# EAGLE design LightPlay1.1 (EAGLE 7.2.0)
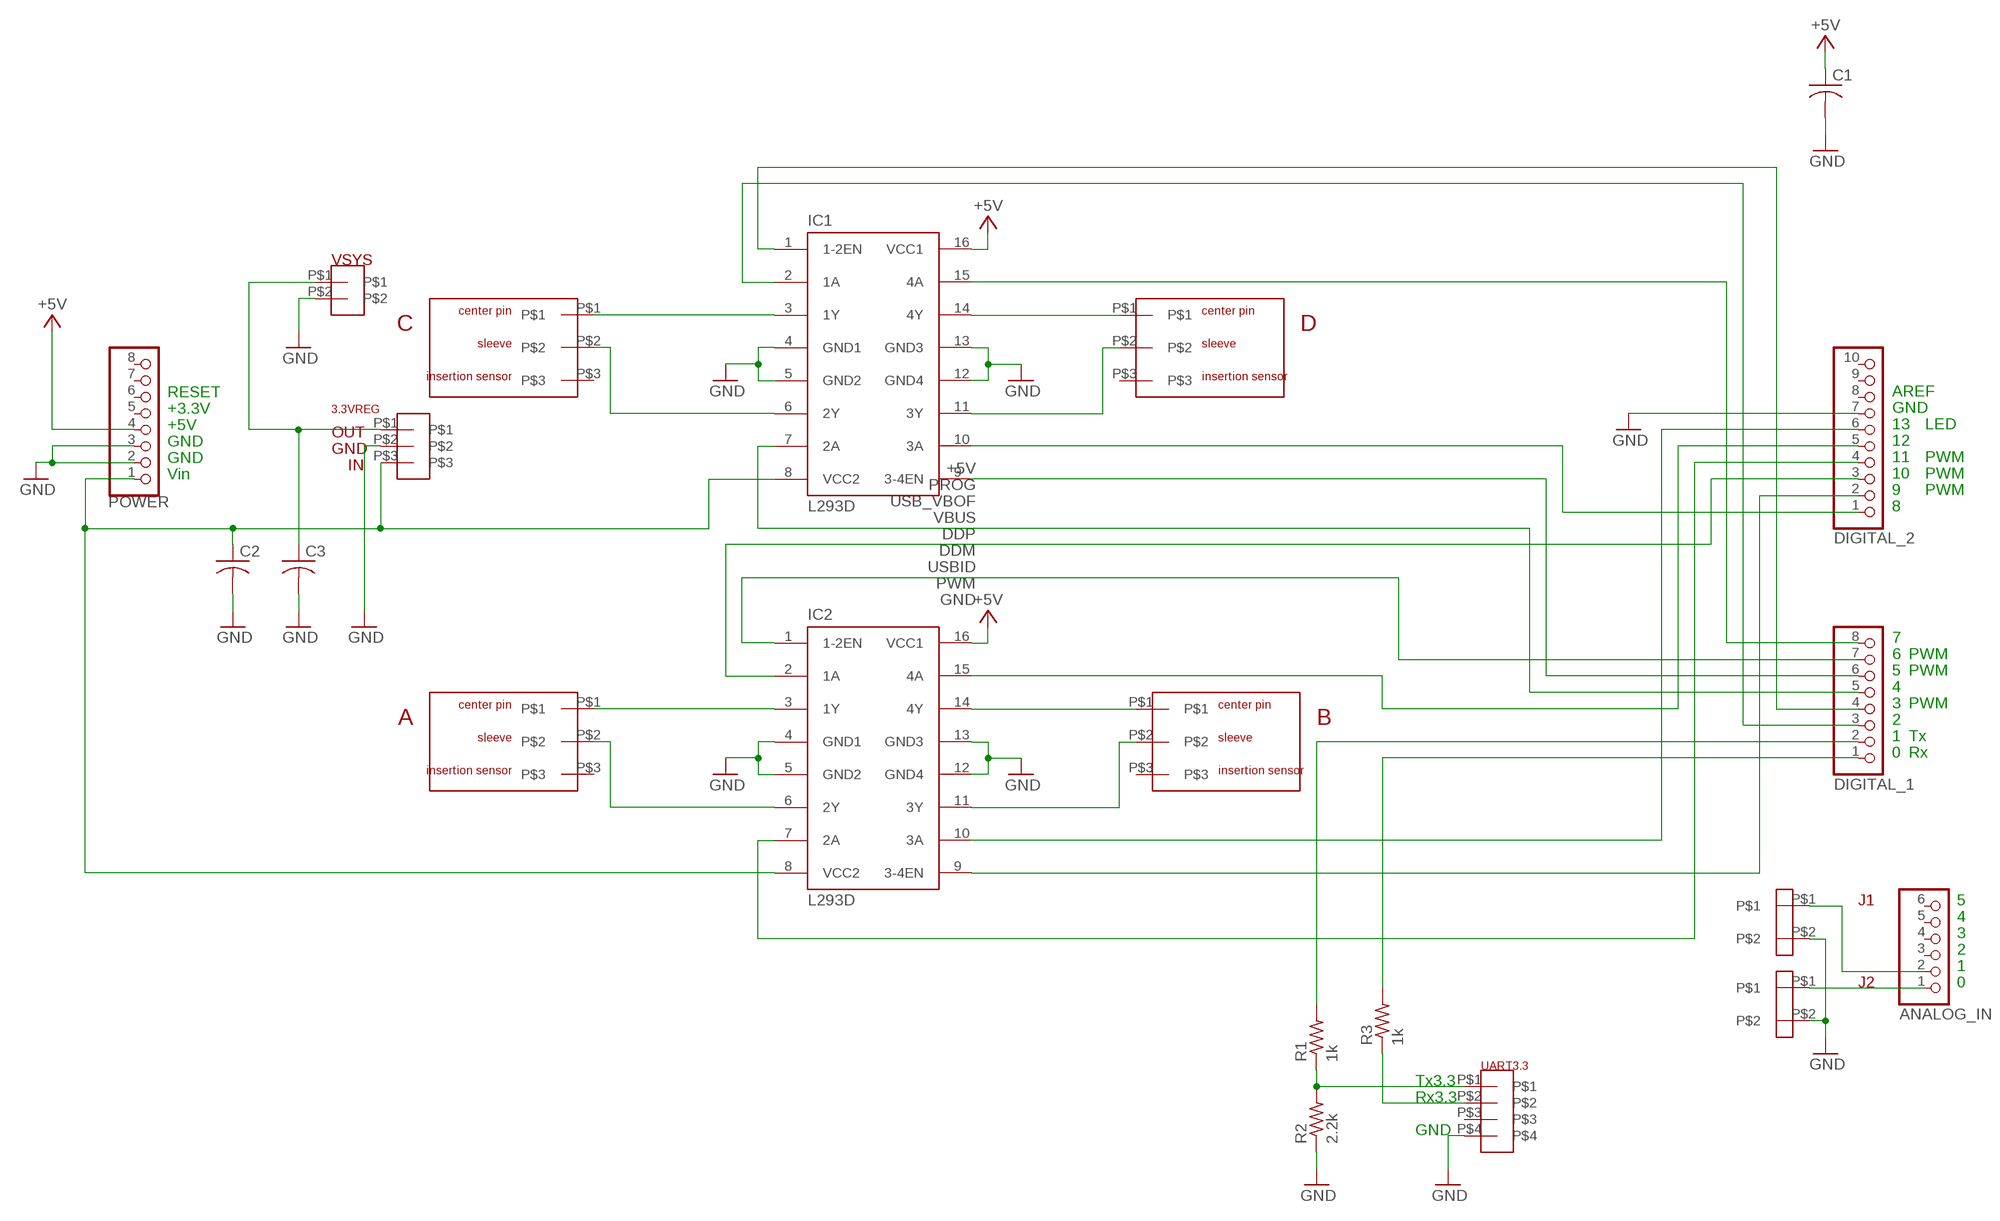
[diagram p0: schematic, sheet 1]

## Parts
3.3VREG  LP38691_33REG  [TO-252]
A  PJ-075DH-SMT-TR  [PJ-075DH-SMT-TR]
ANALOG_IN  PINHD-1X6TH  [1X06-TH]
B  PJ-075DH-SMT-TR  [PJ-075DH-SMT-TR]
C  PJ-075DH-SMT-TR  [PJ-075DH-SMT-TR]
C1  C-USC1206  [C1206]
C2  C-USC1206  [C1206]
C3  C-USC1206  [C1206]
D  PJ-075DH-SMT-TR  [PJ-075DH-SMT-TR]
DIGITAL_1  PINHD-1X8TH  [1X08-TH]
DIGITAL_2  PINHD-1X10TH  [1X10-TH]
IC1  L293D  [DIL16]
IC2  L293D  [DIL16]
J1  3.5MM_2PIN_SCREWTERMINAL_SPARKFUN  [1X02_3.5_SCREWTERM]
J2  3.5MM_2PIN_SCREWTERMINAL_SPARKFUN  [1X02_3.5_SCREWTERM]
POWER  PINHD-1X8TH  [1X08-TH]
R1  1k  R-US_M1206  [M1206]
R2  2.2k  R-US_M1206  [M1206]
R3  1k  R-US_M1206  [M1206]
UART3.3  4PADS_ROBBIE  [1X04_ROBBIE]
VSYS  1X2HEADER_ROBBIE  [1X2HEADER_ROBBIE]

## Nets
+5V: C1.1 IC1.16(VCC1) IC2.16(VCC1) POWER.4
GND: 3.3VREG.P$2 C1.2 C2.2 C3.2 DIGITAL_2.7 IC1.4(GND1) IC1.5(GND2) IC1.12(GND4) IC1.13(GND3) IC2.4(GND1) IC2.5(GND2) IC2.12(GND4) IC2.13(GND3) J1.P$2 J2.P$2 POWER.2 POWER.3 R2.1 UART3.3.P$4 VSYS.P$2
N$1: D.P$2 IC1.11(3Y)
N$2: ANALOG_IN.1 J2.P$1
N$3: D.P$1 IC1.14(4Y)
N$4: B.P$1 IC2.14(4Y)
N$5: ANALOG_IN.2 J1.P$1
N$6: 3.3VREG.P$3 C2.1 IC1.8(VCC2) IC2.8(VCC2) POWER.1
N$7: B.P$2 IC2.11(3Y)
N$8: C.P$1 IC1.3(1Y)
N$9: C.P$2 IC1.6(2Y)
N$10: A.P$1 IC2.3(1Y)
N$11: A.P$2 IC2.6(2Y)
N$12: DIGITAL_1.4 IC1.1(1-2EN)
N$13: DIGITAL_1.6 IC1.9(3-4EN)
N$14: DIGITAL_1.7 IC2.1(1-2EN)
N$15: DIGITAL_2.2 IC2.9(3-4EN)
N$16: DIGITAL_1.3 IC1.2(1A)
N$17: DIGITAL_1.5 IC1.7(2A)
N$18: DIGITAL_1.8 IC1.15(4A)
N$19: DIGITAL_2.1 IC1.10(3A)
N$20: DIGITAL_2.3 IC2.2(1A)
N$21: DIGITAL_2.4 IC2.7(2A)
N$22: DIGITAL_2.5 IC2.15(4A)
N$23: DIGITAL_2.6 IC2.10(3A)
N$25: 3.3VREG.P$1 C3.1 VSYS.P$1
N$26: R1.1 R2.2 UART3.3.P$1
N$27: DIGITAL_1.2 R1.2
N$28: DIGITAL_1.1 R3.2
N$29: R3.1 UART3.3.P$2
Unconnected: A.P$3 ANALOG_IN.3 ANALOG_IN.4 ANALOG_IN.5 ANALOG_IN.6 B.P$3 C.P$3 D.P$3 DIGITAL_2.8 DIGITAL_2.9 DIGITAL_2.10 POWER.5 POWER.6 POWER.7 POWER.8 UART3.3.P$3

## Notes on the sheet
- RESET | AREF
- +3.3V | GND
- +5V | 13 | LED
- GND | 12
- GND | +5V | 11 | PWM
- Vin | PROG | 10 | PWM
- USB_VBOF | 9 | PWM
- VBUS | 8
- DDP
- DDM
- USBID
- PWM
- GND
- 7
- 6 | PWM
- 5 | PWM
- 4
- 3 | PWM
- 2
- 1 | Tx
- 0 | Rx
- 5
- 4
- 3
- 2
- 1
- 0
- Tx3.3
- Rx3.3
- GND

## Library data of the parts
3.3VREG = robbie:LP38691_33REG
A B C D = robbie:PJ-075DH-SMT-TR
ANALOG_IN = SmartPrj:PINHD-1X6: PIN HEADER
C1-C3 = resistor:C-US: CAPACITOR, American symbol
DIGITAL_1 POWER = SmartPrj:PINHD-1X8: PIN HEADER
DIGITAL_2 = SmartPrj:PINHD-1X10: PIN HEADER
IC1 IC2 = st-microelectronics:L293D: PUSH-PULL 4 CHANNEL DRIVER; MPN: L293D; OC_FARNELL: 9589619; OC_NEWARK: 56P8249
J1 J2 = robbie:3.5MM_2PIN_SCREWTERMINAL_SPARKFUN
R1-R3 = robbie:R-US_: RESISTOR, American symbol
UART3.3 = robbie:4PADS_ROBBIE
VSYS = robbie:1X2HEADER_ROBBIE

## Net classes
0 default: width 0.203 mm, drill 0.305 mm, clearance 0.178 mm
1 power: width 0.254 mm, drill 0.61 mm, clearance 0.203 mm
2 VIN: width 0.61 mm, drill 0.813 mm, clearance 0.305 mm
3 usbvcc: width 0.508 mm, drill 0.508 mm, clearance 0.152 mm
4 aref: width 0.406 mm

## Board
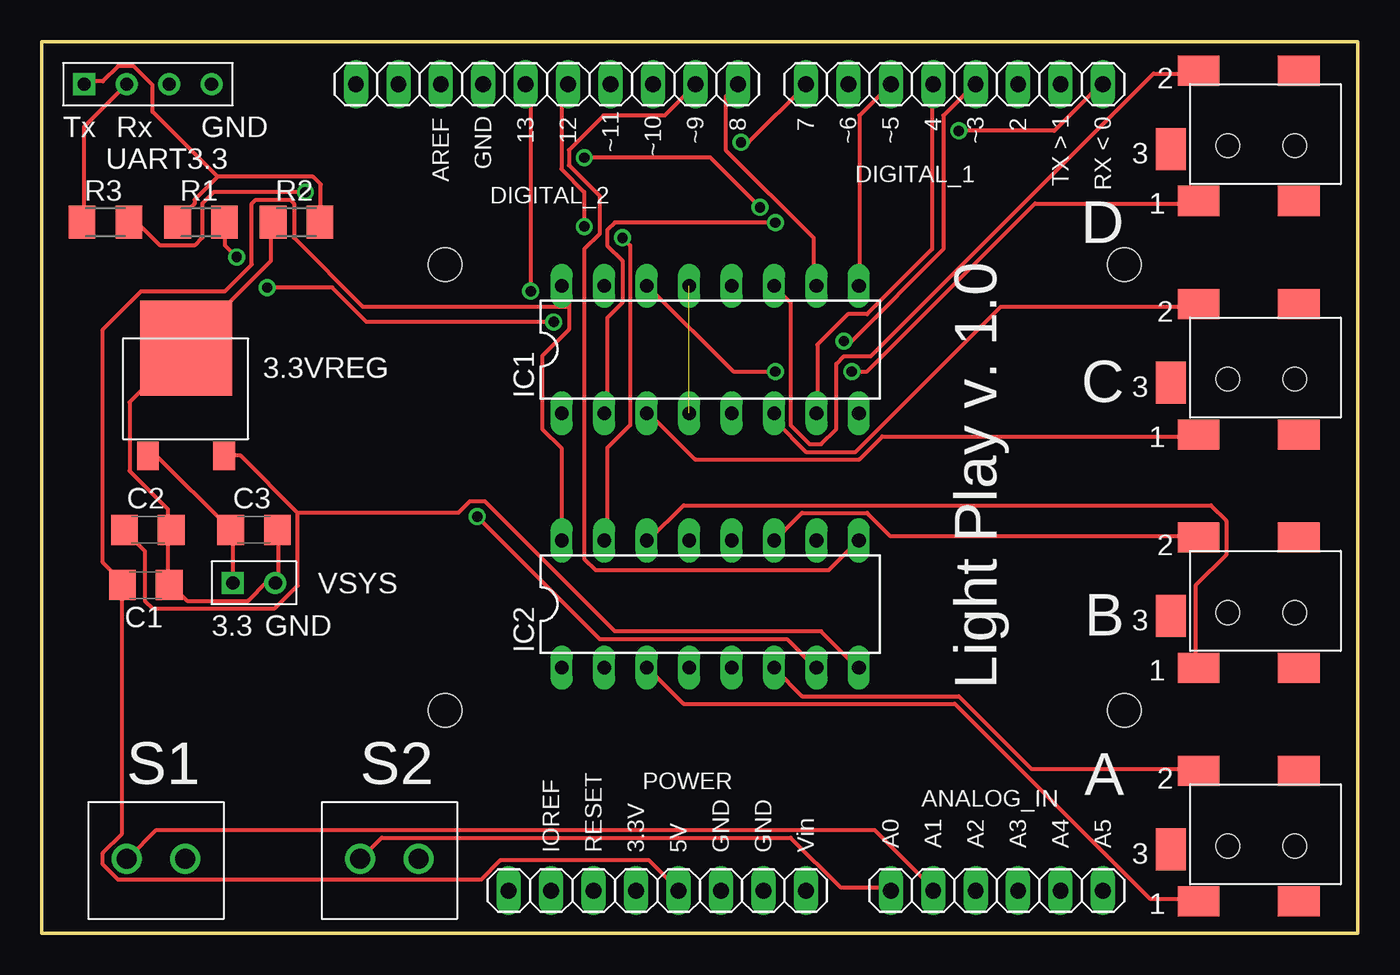
[diagram p1: board, top side]
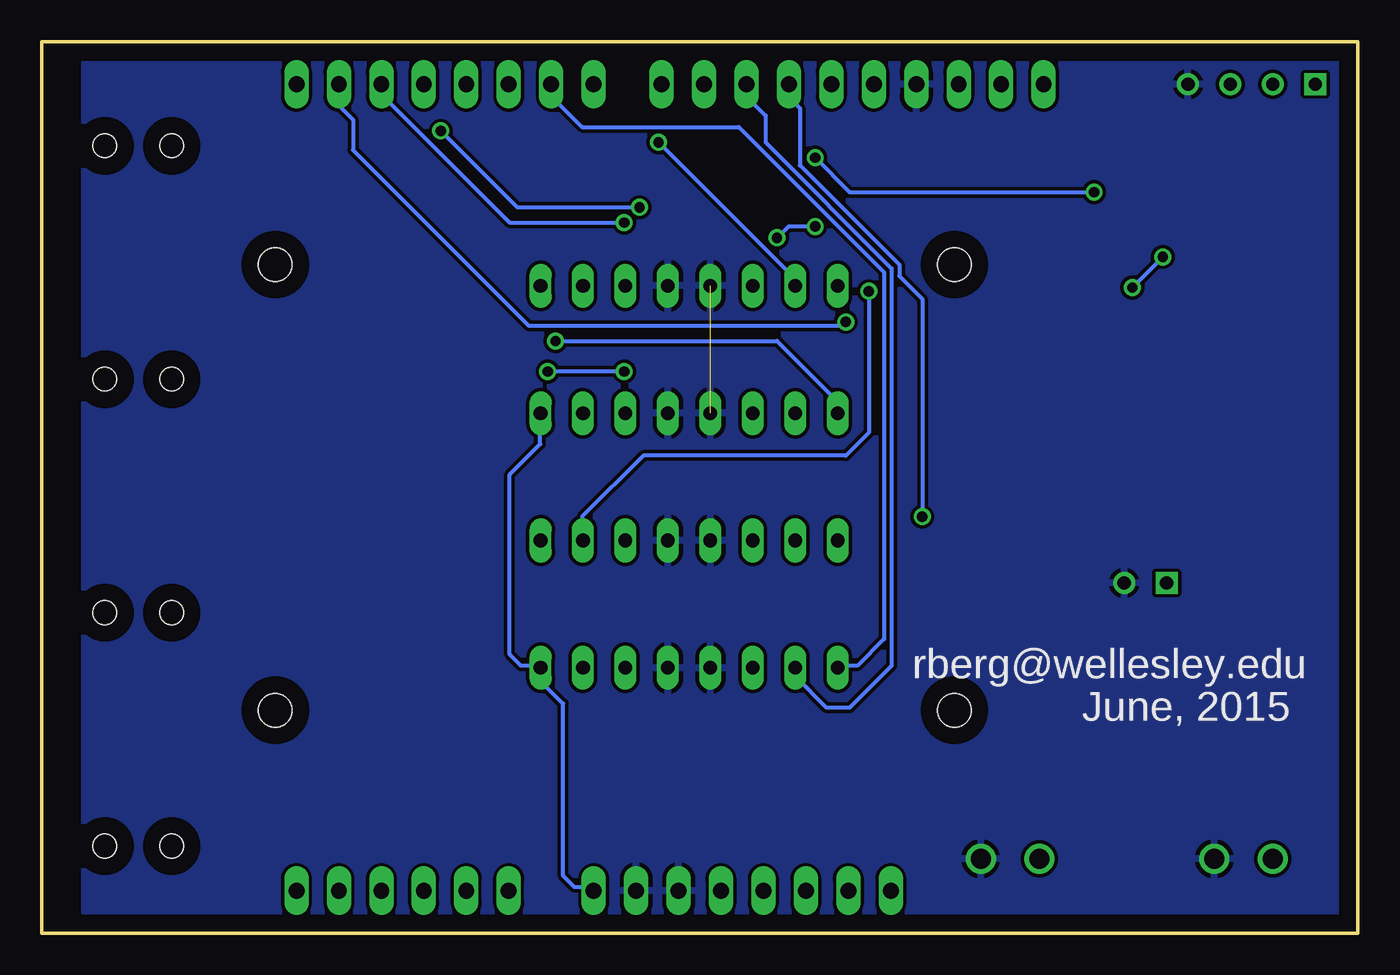
[diagram p2: board, bottom side, seen from below]

Size 78.74 x 53.34 mm. Coordinates in mm from the lower left corner, seen from the top.
Outline: 78.74,53.34 0,53.34 0,0 78.74,0 78.74,53.34
Copper layers (1*16): Top 0.035mm / dielectric 1.5mm / Bottom 0.035mm
Design rules "default": minimum track width 10mil, minimum drill 24mil, track to track 8mil, track to pad 8mil, pad to pad 8mil, via to via 8mil, smd to smd 8mil, copper to edge 40mil, drill to drill 8mil, minimum pad ring 10mil, minimum via ring 8mil, stop-mask expansion 4mil, vias tented up to drill 0mil, thermal gap 10mil
Holes 2 mm at 64.77,40.01 24.13,40.01 24.13,13.34 64.77,13.34

### Footprints (pad centres in the part's own frame; a part is rotated, then mirrored left to right if it is on the bottom)
TO-252 = smd 1.3 x 1.7: P$1 0,0; P$3 4.57,0 | smd 5.5 x 5.7: P$2 2.285,6.44
PJ-075DH-SMT-TR = smd 2.5 x 1.8: P$1 0,0; P$2 0,-7.8; P$4 -6,0; P$5 -6,-7.8 | smd 1.8 x 2.5: P$3 1.65,-3.1 | hole 1.4: -5.75,-3.3; -1.75,-3.3
1X06-TH = drill 0.95 pad 1.422 long: 1 -6.35,0; 2 -3.81,0; 3 -1.27,0; 4 1.27,0; 5 3.81,0; 6 6.35,0
C1206 = smd 1.6 x 1.8: 1 -1.4,0; 2 1.4,0
1X08-TH = drill 0.95 pad 1.422 long: 1 -8.89,0; 2 -6.35,0; 3 -3.81,0; 4 -1.27,0; 5 1.27,0; 6 3.81,0; 7 6.35,0; 8 8.89,0
1X10-TH = drill 0.95 pad 1.422 long: 1 -11.43,0; 2 -8.89,0; 3 -6.35,0; 4 -3.81,0; 5 -1.27,0; 6 1.27,0; 7 3.81,0; 8 6.35,0; 9 8.89,0; 10 11.43,0
DIL16 = drill 0.813 long: 1 -8.89,-3.81; 2 -6.35,-3.81; 3 -3.81,-3.81; 4 -1.27,-3.81; 5 1.27,-3.81; 6 3.81,-3.81; 7 6.35,-3.81; 8 8.89,-3.81; 9 8.89,3.81; 10 6.35,3.81; 11 3.81,3.81; 12 1.27,3.81; 13 -1.27,3.81; 14 -3.81,3.81; 15 -6.35,3.81; 16 -8.89,3.81
1X02_3.5_SCREWTERM = drill 1.2: P$1 0,0; P$2 3.5,0
M1206 = smd 1.6 x 2: 1 -1.4,0; 2 1.4,0
1X04_ROBBIE = drill 0.8 square: P$1 0,0 | drill 0.8: P$2 2.54,0; P$3 5.08,0; P$4 7.62,0
1X2HEADER_ROBBIE = drill 0.8 square: P$1 0,0 | drill 0.8: P$2 2.54,0

### Placement (x,y rotation side)
3.3VREG  6.35,28.57 0 top
A  69.22,1.91 180 top
ANALOG_IN  57.15,2.54 0 top
B  69.22,15.88 180 top
C  69.22,29.84 180 top
C1  6.22,20.83 0 top
C2  6.35,24.13 0 top
C3  12.7,24.13 0 top
D  69.22,43.81 180 top
DIGITAL_1  54.61,50.8 180 top
DIGITAL_2  30.23,50.8 180 top
IC1  40.01,34.92 0 top
IC2  40.01,19.68 0 top
J1  5.08,4.45 0 top
J2  19.05,4.45 0 top
POWER  36.83,2.54 180 top
R1  9.53,42.55 0 top
R2  15.24,42.55 0 top
R3  3.81,42.55 0 top
UART3.3  2.54,50.8 0 top
VSYS  11.43,20.95 0 top

### Tracks (layer width: path | path; a pad name or v marks a point on that pad's centre or on a via)
+5V
  Top 0.254: 31.55,37.49 31.55,38.41 31.32,38.63 IC1.16 | 31.55,37.49 31.55,36.12 29.95,34.52 29.95,30.18 31.09,29.03 31.09,23.55 IC2.16 | POWER.4 37.95,2.74 36.35,4.34 27.43,4.34 26.29,3.2 4.57,3.2 3.66,4.12 3.66,4.8 4.8,5.94 4.8,20.8 C1.1 4.8,21.03 3.66,22.17 3.66,36.12 5.94,38.41 10.97,38.41 12.57,40.01 12.57,43.66 12.8,43.89 14.86,43.89 15.09,43.66 15.09,41.6 19.2,37.49 31.55,37.49
GND  (1 unrouted)
  Top 0.254: C3.2 14.17,24 14.17,21.03 VSYS.P$2 13.95,21.03 13.49,21.03 12.34,19.89 8.69,19.89 7.77,20.8 C1.2 7.54,21.03 7.54,24 C2.2 7.54,24.23 7.54,25.38 5.26,27.66 5.26,31.77 8.46,34.98 3.3VREG.P$2 8.69,35.2 13.72,40.23 13.72,42.52 R2.1
  pour Bottom: 1.27,52.07 76.2,52.07 76.2,1.27 1.27,1.27
N$1
  Top 0.254: D.P$2 69.04,51.44 66.52,51.44 49.61,34.52 48.01,34.52 47.55,34.06 47.55,30.18 46.63,29.26 45.95,29.26 44.81,30.4 44.81,37.72 43.89,38.63 IC1.11
N$2
  Top 0.254: ANALOG_IN.1 50.75,2.74 47.78,2.74 44.81,5.71 20.34,5.71 19.2,4.57 J2.P$1
N$3  (via drill 0.61)
  Top 0.254: v48.46,33.6 49.38,33.6 59.44,43.66 69.04,43.66 D.P$1 | v43.89,33.6 41.38,33.6 36.35,38.63 IC1.14
  Bottom 0.254: v43.89,33.6 v48.46,33.6
N$4
  Top 0.254: B.P$1 69.04,16 69.04,20.8 70.87,22.63 70.87,24.69 69.95,25.6 38.41,25.6 36.35,23.55 IC2.14
N$5
  Top 0.254: ANALOG_IN.2 53.26,2.74 49.84,6.17 6.86,6.17 5.26,4.57 J1.P$1
N$6
  Top 0.254: 3.3VREG.P$3 11.89,28.57 15.32,25.15 | 15.32,25.15 15.32,20.8 13.95,19.43 6.63,19.43 6.17,19.89 6.17,22.86 5.03,24 C2.1 | 15.32,25.15 24.92,25.15 25.6,25.83 26.52,25.83 34.29,18.06 46.63,18.06 48.69,16 IC2.8
  Bottom 0.254: POWER.1 45.72,2.74 46.86,2.74 47.55,3.43 47.55,13.72 48.69,14.86 48.69,15.77 IC2.8 48.92,16 50.06,16 50.75,16.69 50.75,27.43 48.92,29.26 48.92,31.09 IC1.8
N$7
  Top 0.254: B.P$2 69.04,23.77 50.75,23.77 49.38,25.15 45.49,25.15 43.89,23.55 IC2.11
N$8
  Top 0.254: C.P$1 69.04,29.72 50.29,29.72 48.92,28.35 39.09,28.35 36.35,31.09 IC1.3
N$9
  Top 0.254: C.P$2 69.04,37.49 57.38,37.49 48.69,28.8 45.72,28.8 43.89,30.63 43.89,31.09 IC1.6
N$10
  Top 0.254: A.P$1 69.04,2.06 66.29,2.06 54.63,13.72 38.41,13.72 36.35,15.77 IC2.3
N$11
  Top 0.254: A.P$2 69.04,9.83 59.21,9.83 54.86,14.17 45.49,14.17 43.89,15.77 IC2.6
N$12  (via drill 0.61)
  Top 0.254: v48.01,35.43 48.46,35.43 53.95,40.92 53.95,48.92 55.78,50.75 DIGITAL_1.4
  Bottom 0.254: v48.01,35.43 34.75,35.43 31.32,32 31.32,31.32 IC1.1
N$13
  Top 0.254: DIGITAL_1.6 48.92,48.92 48.92,38.86 IC1.9
N$14
  Bottom 0.254: IC2.1 31.09,16 29.95,16 28.35,17.6 28.35,39.55 37.03,48.23 46.41,48.23 48.23,50.06 48.23,50.75 DIGITAL_1.7
N$15
  Top 0.254: IC2.9 48.69,23.32 47.09,21.72 33.15,21.72 32.46,22.4 32.46,40.92 33.38,41.83 33.38,44.12 31.55,45.95 31.55,46.86 33.6,48.92 37.26,48.92 39.09,50.75 DIGITAL_2.2
N$16  (via drill 0.61)
  Top 0.254: v43.89,42.52 34.29,42.52 33.83,42.06 33.83,41.15 34.75,40.23 34.75,37.72 33.83,36.8 33.83,31.32 IC1.2
  Bottom 0.254: v43.89,42.52 50.75,42.52 58.29,50.06 58.29,50.75 DIGITAL_1.3
N$17
  Top 0.254: IC1.7 46.41,31.32 46.41,35.2 48.23,37.03 49.38,37.03 53.26,40.92 53.26,50.75 DIGITAL_1.5
N$18  (via drill 0.61)
  Top 0.254: v41.83,47.32 42.29,47.32 45.72,50.75 DIGITAL_1.8
  Bottom 0.254: v41.83,47.32 33.83,39.32 33.83,38.86 IC1.15
N$19
  Top 0.254: DIGITAL_2.1 40.92,50.06 40.92,46.86 46.18,41.6 46.18,38.86 IC1.10
N$20
  Bottom 0.254: DIGITAL_2.3 36.58,50.06 35.43,48.92 35.43,47.32 27.89,39.78 27.89,16 30.4,13.49 31.77,13.49 33.6,15.32 33.6,15.77 IC2.2
N$21  (via drill 0.61)
  Top 0.254: v26.06,24.92 33.38,17.6 44.58,17.6 46.18,16 IC2.7
  Bottom 0.254: v26.06,24.92 26.06,37.95 27.43,39.32 27.43,40.01 33.38,45.95 33.38,49.38 33.83,49.84 33.83,50.75 DIGITAL_2.4
N$22  (via drill 0.61)
  Top 0.254: v34.75,41.6 35.2,41.15 35.2,30.4 33.83,29.03 33.83,23.55 IC2.15 | v32.46,42.29 32.46,44.35 31.09,45.72 31.09,50.52 31.32,50.75 DIGITAL_2.5
  Bottom 0.254: v34.75,41.6 34.06,42.29 v32.46,42.29
N$23  (via drill 0.61)
  Top 0.254: v29.26,38.41 29.26,50.52 29.03,50.75 DIGITAL_2.6
  Bottom 0.254: v29.26,38.41 29.26,29.95 30.63,28.57 42.75,28.57 46.41,24.92 46.41,23.55 IC2.10
N$25
  Top 0.254: 3.3VREG.P$1 6.86,28.57 11.2,24.23 C3.1 11.43,24 VSYS.P$1
N$26
  Top 0.254: 10.52,45.26 9.14,43.89 9.14,43.66 8.23,42.75 R1.1 | 10.52,45.26 16.23,45.26 16.69,44.81 16.69,42.75 R2.2 | 10.52,45.26 6.63,49.15 6.63,50.75 5.49,51.89 4.57,51.89 3.66,50.98 2.74,50.98 UART3.3.P$1
N$27  (via drill 0.61)
  Top 0.254: v11.66,40.46 10.97,41.15 10.97,42.52 R1.2 | v13.49,38.63 17.37,38.63 19.43,36.58 v30.63,36.58
  Bottom 0.254: v13.49,38.63 v11.66,40.46 | v30.63,36.58 30.86,36.35 49.61,36.35 60.12,46.86 60.12,48.69 60.81,49.38 60.81,50.75 DIGITAL_1.2
N$28  (via drill 0.61)
  Top 0.254: v15.77,44.35 10.29,44.35 9.6,43.66 9.6,41.6 9.14,41.15 7.09,41.15 5.71,42.52 5.26,42.52 R3.2 | v32.46,46.41 40.01,46.41 v42.98,43.43 | v54.86,48.01 60.58,48.01 63.32,50.75 DIGITAL_1.1
  Bottom 0.254: v15.77,44.35 30.4,44.35 v32.46,46.41 | v42.98,43.43 50.29,43.43 v54.86,48.01
N$29
  Top 0.254: UART3.3.P$2 2.52,48.23 2.52,42.75 R3.1

### Text on the board
tPlace: Tx | Rx | GND | 8 | 7 | 4 | 2 | 13 | 12 | ~11 | ~9 | ~6 | ~5 | ~3 | GND | ~10 | AREF | TX > 1 | RX < 0 | 3.3 | GND | Light Play v. 1.0 | S1 | S2 | IOREF | RESET | 3.3V | 5V | GND | GND | Vin | A0 | A1 | A2 | A3 | A4 | A5
bPlace: rberg@wellesley.edu | June, 2015